# EAGLE design sensor-board (EAGLE 7.1.0)
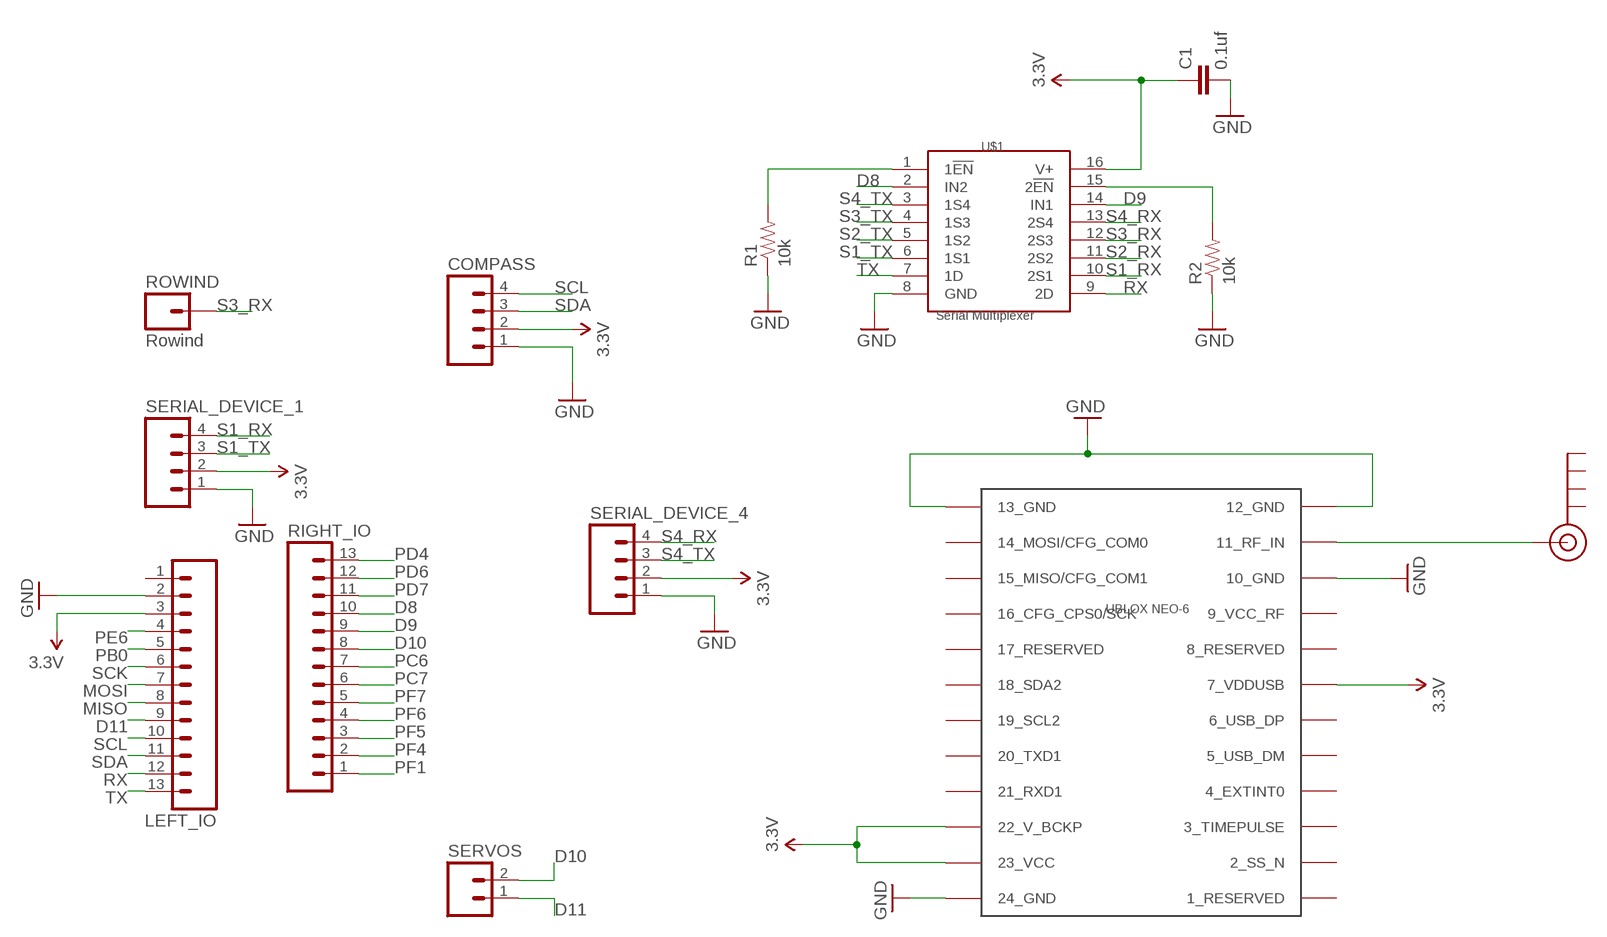
[diagram p0: schematic, sheet 1]

## Parts
C1  0.1uf  C0805  [C0805]
COMPASS  M04PTH  [1X04]
J$1  SMA_EDGE  [SMA-EDGE]
LEFT_IO  M13  [1X13]
R1  10k  10KOHM-1/4W-1%(PTH)HORIZ  [AXIAL-0.3]
R2  10k  10KOHM-1/4W-1%(PTH)HORIZ  [AXIAL-0.3]
RIGHT_IO  M13  [1X13]
ROWIND  Rowind  M01PTH  [1X01]
SERIAL_DEVICE_1  M04PTH  [1X04]
SERIAL_DEVICE_4  M04PTH  [1X04]
SERVOS  M02PTH  [1X02]
U$1  Serial Multiplexer  TS3A5017  [16TSSOP]
U$2  UBLOX_NEO-6  [UBLOX_NEO-6P]

## Nets
3.3V: C1.1 COMPASS.2 LEFT_IO.3 SERIAL_DEVICE_1.2 SERIAL_DEVICE_4.2 U$1.16(V+) U$2.7_VDDUSB U$2.22_V_BCKP U$2.23_VCC
D8: RIGHT_IO.10 U$1.2(IN2)
D9: RIGHT_IO.9 U$1.14(IN1)
D10: RIGHT_IO.8 SERVOS.2
D11: LEFT_IO.9 SERVOS.1
GND: C1.2 COMPASS.1 LEFT_IO.2 R1.P$1 R2.P$1 SERIAL_DEVICE_1.1 SERIAL_DEVICE_4.1 U$1.8(GND) U$2.10_GND U$2.12_GND U$2.13_GND U$2.24_GND
MISO: LEFT_IO.8
MOSI: LEFT_IO.7
N$1: R1.P$2 U$1.1(1!EN)
N$2: R2.P$2 U$1.15(2!EN)
N$3: J$1.SIG(SIGNAL) U$2.11_RF_IN
PB0: LEFT_IO.5
PC6: RIGHT_IO.7
PC7: RIGHT_IO.6
PD4: RIGHT_IO.13
PD6: RIGHT_IO.12
PD7: RIGHT_IO.11
PE6: LEFT_IO.4
PF1: RIGHT_IO.1
PF4: RIGHT_IO.2
PF5: RIGHT_IO.3
PF6: RIGHT_IO.4
PF7: RIGHT_IO.5
RX: LEFT_IO.12 U$1.9(2D)
S1_RX: SERIAL_DEVICE_1.4 U$1.10(2S1)
S1_TX: SERIAL_DEVICE_1.3 U$1.6(1S1)
S2_RX: U$1.11(2S2)
S2_TX: U$1.5(1S2)
S3_RX: ROWIND.1 U$1.12(2S3)
S3_TX: U$1.4(1S3)
S4_RX: SERIAL_DEVICE_4.4 U$1.13(2S4)
S4_TX: SERIAL_DEVICE_4.3 U$1.3(1S4)
SCK: LEFT_IO.6
SCL: COMPASS.4 LEFT_IO.10
SDA: COMPASS.3 LEFT_IO.11
TX: LEFT_IO.13 U$1.7(1D)
Unconnected: J$1.GND@0(GND) J$1.GND@1(GND) J$1.GND@2(GND) J$1.GND@3(GND) LEFT_IO.1 U$2.1_RESERVED U$2.2_SS_N U$2.3_TIMEPULSE U$2.4_EXTINT0 U$2.5_USB_DM U$2.6_USB_DP U$2.8_RESERVED U$2.9_VCC_RF U$2.14_MOSI/CFG_COM0 U$2.15_MISO/CFG_COM1 U$2.16_CFG_CPS0/SCK U$2.17_RESERVED U$2.18_SDA2 U$2.19_SCL2 U$2.20_TXD1 U$2.21_RXD1

## Library data of the parts
C1 = ELL-i-Passives:C: Surface Mount Capasitors — in standard sizes A capacitor used to store energy electrostatically in an electric field. If you need a high-value capacitor, consider using a polarised capacitor to save space. Wikipedia article on capacitors <https://en.wikipedia.org/wiki/Capacitor>
COMPASS SERIAL_DEVICE_1 SERIAL_DEVICE_4 = SparkFun-Connectors:M04: Header 4 Standard 4-pin 0.1" header. Use with straight break away headers (SKU : PRT-00116), right angle break away headers (PRT-00553), swiss pins (PRT-00743), machine pins (PRT-00117), and female headers (PRT-00115). Molex polarized connector foot print use with SKU : PRT-08231 with associated crimp pins and housings. 1MM SMD Version SKU: PRT-10208
J$1 = SparkFun-Connectors:SMA_EDGE: SMA Antenna Connector End launch SMA connector. The paste layer has been removed so that the connector can be hand soldered onto the board after reflow.
LEFT_IO RIGHT_IO = SparkFun-Connectors:M13: 13-pin single row .1" header
R1 R2 = SparkFun-Resistors:10KOHM-1/4W-1%(PTH): RES-12183; PROD_ID: RES-12183
ROWIND = SparkFun-Connectors:M01: Header 1 Standard 1-pin 0.1" header. Use with straight break away headers (SKU : PRT-00116), right angle break away headers (PRT-00553), swiss pins (PRT-00743), machine pins (PRT-00117), and female headers (PRT-00115).
SERVOS = SparkFun-Connectors:M02: Standard 2-pin 0.1" header. Use with - straight break away headers ( PRT-00116) - right angle break away headers (PRT-00553) - swiss pins (PRT-00743) - machine pins (PRT-00117) - female headers (PRT-00115) Molex polarized connector foot print use with: PRT-08233 with associated crimp pins and housings. 2.54_SCREWTERM for use with PRT-10571. 3.5mm Screw Terminal footprints for PRT-08084 5mm Screw Terminal footprints for use with PRT-08432
U$1 = BaseApp:TS3A5017
U$2 = Ava:UBLOX_NEO-6: UBLOX NEO-6 GPS MODULE Author Anthony Stirk / http://ava.upuaut.net http://www.u-blox.com/images/downloads/Product_Docs/LEA-6_NEO-6_MAX-6_HardwareIntegrationManual_%28GPS.G6-HW-09007%29.pdf http://www.u-blox.com/images/downloads/Product_Docs/NEO-6_DataSheet_%28GPS.G6-HW-09005%29.pdf

## Board
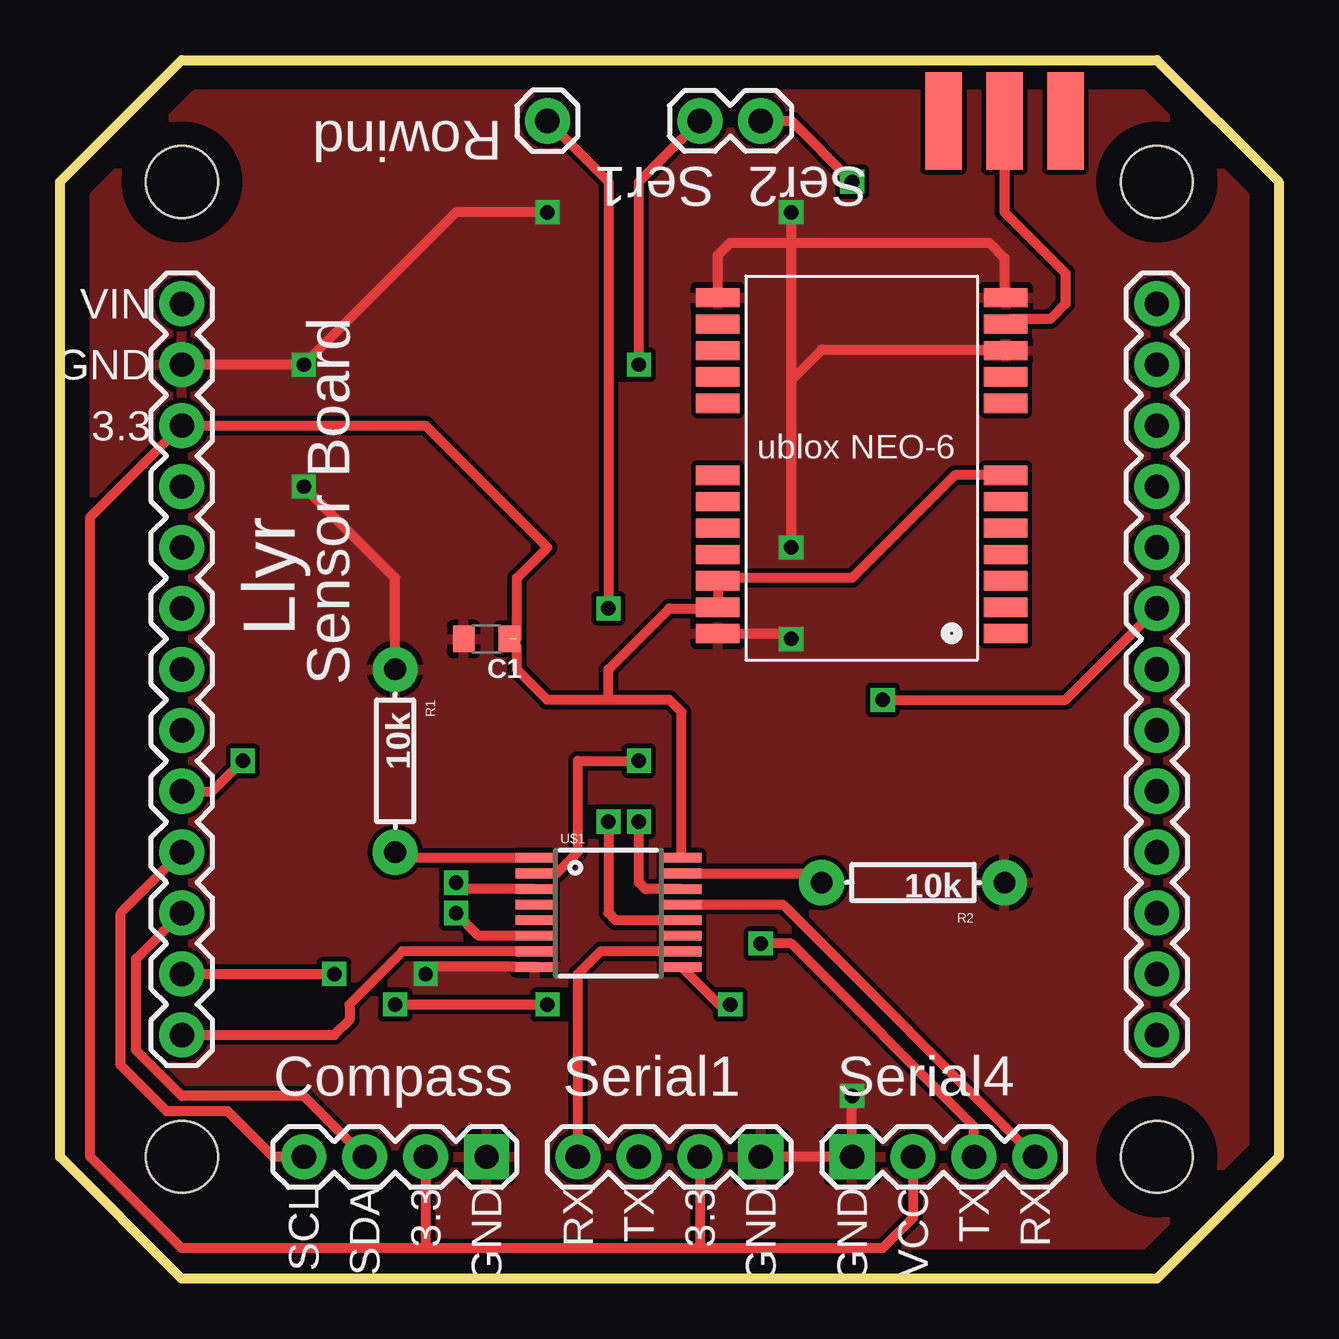
[diagram p1: board, top side]
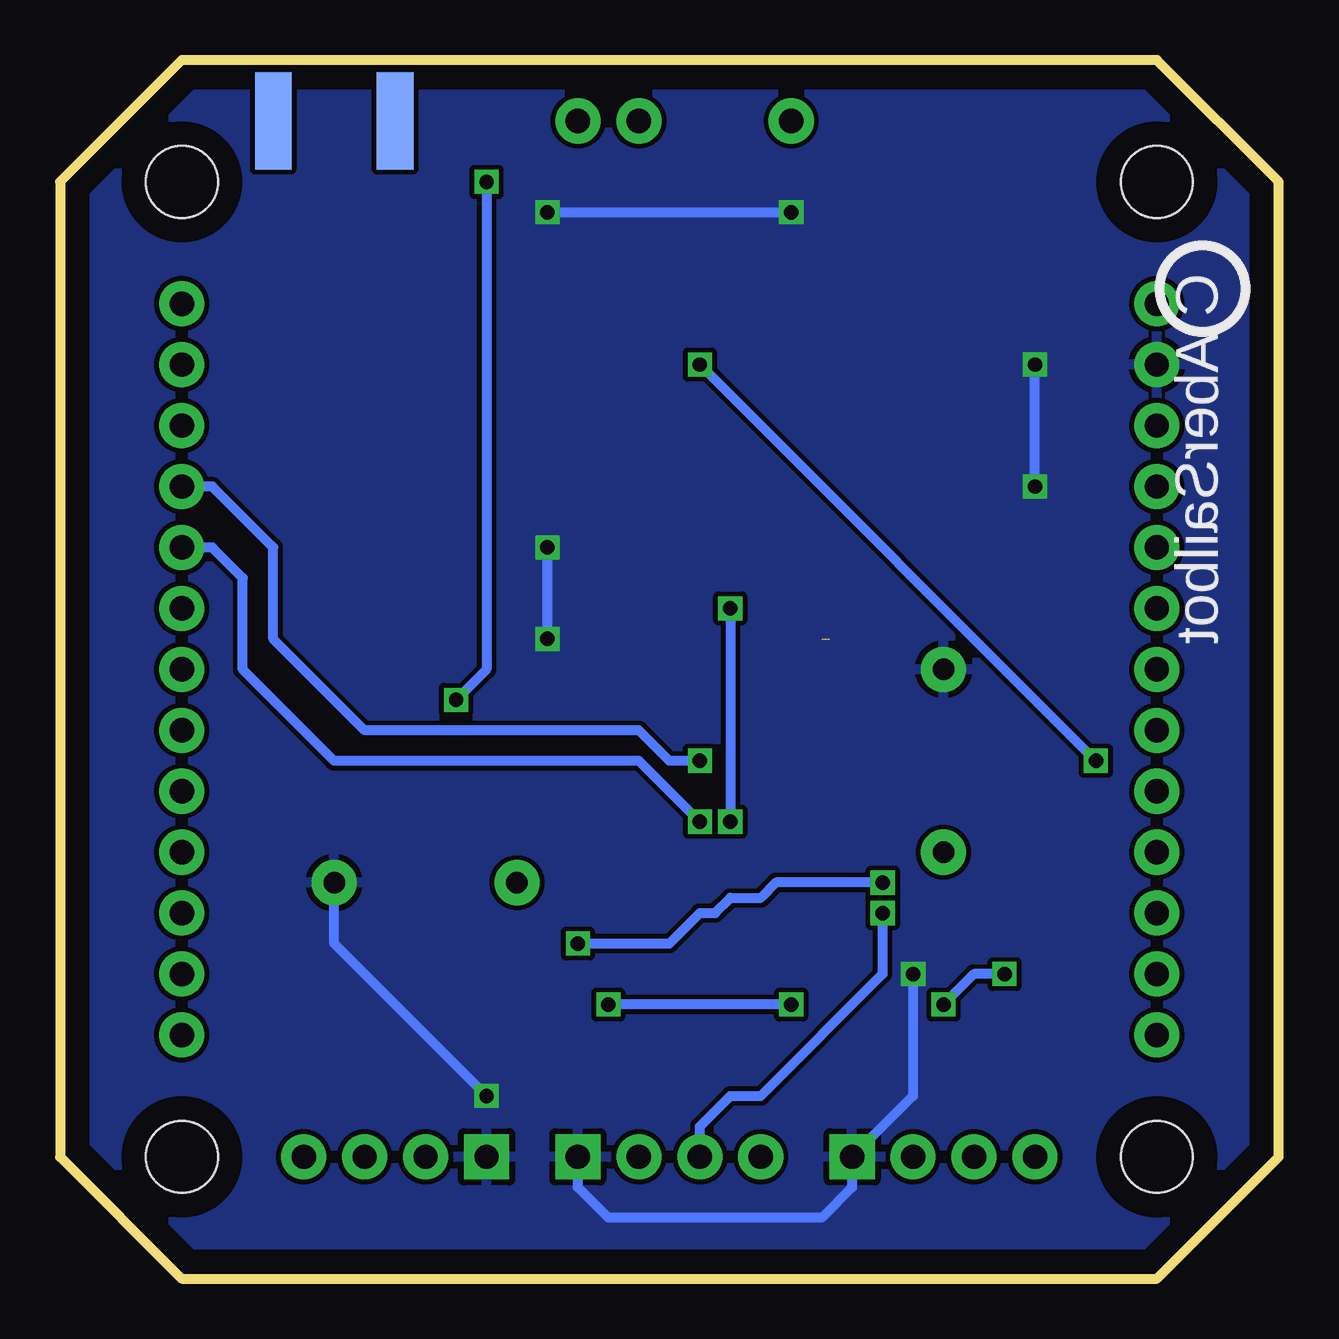
[diagram p2: board, bottom side, seen from below]

Size 50.8 x 50.8 mm. Coordinates in mm from the lower left corner, seen from the top.
Outline: 0,5.08 0,45.72 5.08,50.8 45.72,50.8 50.8,45.72 50.8,5.08 45.72,0 5.08,0 0,5.08
Copper layers (1*16): Top 0.035mm / dielectric 1.5mm / Bottom 0.035mm
Design rules "default": minimum track width 10mil, minimum drill 24mil, track to track 8mil, track to pad 8mil, pad to pad 8mil, via to via 8mil, smd to smd 8mil, copper to edge 40mil, drill to drill 8mil, minimum pad ring 10mil, minimum via ring 8mil, stop-mask expansion 4mil, vias tented up to drill 0mil, thermal gap 10mil
Holes 3 mm at 5.08,45.72 45.72,45.72 45.72,5.08 5.08,5.08

### Footprints (pad centres in the part's own frame; a part is rotated, then mirrored left to right if it is on the bottom)
C0805 = smd 0.9 x 1.1: 1 -0.95,0; 2 0.95,0
1X04 = drill 1.016 pad 1.88 square: 1 0,0 | drill 1.016 pad 1.88: 2 2.54,0; 3 5.08,0; 4 7.62,0
SMA-EDGE = smd 1.524 x 4.064: GND@0 0,0; GND@1 5.08,0; SIG 2.54,0 | smd 1.524 x 4.064 bottom: GND@2 0,0; GND@3 5.08,0
1X13 = drill 1.016 pad 1.88: 1 0,0; 2 2.54,0; 3 5.08,0; 4 7.62,0; 5 10.16,0; 6 12.7,0; 7 15.24,0; 8 17.78,0; 9 20.32,0; 10 22.86,0; 11 25.4,0; 12 27.94,0; 13 30.48,0
AXIAL-0.3 = drill 0.9 pad 1.88: P$1 -3.81,0; P$2 3.81,0
1X01 = drill 1.016 pad 1.88: 1 0,0
1X02 = drill 1.016 pad 1.88: 1 0,0; 2 2.54,0
16TSSOP = smd 0.4 x 1.65: 1 -2.305,-3.05; 2 -1.655,-3.05; 3 -1.005,-3.05; 4 -0.355,-3.05; 5 0.295,-3.05; 6 0.945,-3.05; 7 1.595,-3.05; 8 2.245,-3.05; 9 2.245,3.05; 10 1.595,3.05; 11 0.945,3.05; 12 0.295,3.05; 13 -0.355,3.05; 14 -1.005,3.05; 15 -1.655,3.05; 16 -2.305,3.05
UBLOX_NEO-6P = smd 1.8 x 0.8: 1_RESERVED 6.4,-7.4; 2_SS_N 6.4,-6.3; 3_TIMEPULSE 6.4,-5.2; 4_EXTINT0 6.4,-4.1; 5_USB_DM 6.4,-3; 6_USB_DP 6.4,-1.9; 7_VDDUSB 6.4,-0.8; 8_RESERVED 6.4,2.2; 9_VCC_RF 6.4,3.3; 10_GND 6.4,4.4; 11_RF_IN 6.4,5.5; 12_GND 6.4,6.6; 13_GND -5.6,6.6; 14_MOSI/CFG_COM0 -5.6,5.5; 15_MISO/CFG_COM1 -5.6,4.4; 16_CFG_CPS0/SCK -5.6,3.3; 17_RESERVED -5.6,2.2; 18_SDA2 -5.6,-0.8; 19_SCL2 -5.6,-1.9; 20_TXD1 -5.6,-3; 21_RXD1 -5.6,-4.1; 22_V_BCKP -5.6,-5.2; 23_VCC -5.6,-6.3; 24_GND -5.6,-7.4

### Placement (x,y rotation side)
C1  17.78,26.67 180 top
COMPASS  17.78,5.08 180 top
J$1  36.83,48.26 0 top
LEFT_IO  5.08,40.64 270 top
R1  13.97,21.59 270 top
R2  35.56,16.51 180 top
RIGHT_IO  45.72,10.16 90 top
ROWIND  20.32,48.26 0 top
SERIAL_DEVICE_1  29.21,5.08 180 top
SERIAL_DEVICE_4  33.02,5.08 0 top
SERVOS  26.67,48.26 0 top
U$1  22.86,15.24 270 top
U$2  33.02,34.29 0 top

### Tracks (layer width: path | path; a pad name or v marks a point on that pad's centre or on a via)
3.3V  (1 unrouted)
  Top 0.406: U$2.7_VDDUSB 37.3,33.49 33.02,29.21 27.54,29.21 U$2.22_V_BCKP | LEFT_IO.3 15.24,35.56 20.32,30.48 19.05,29.21 19.05,26.67 | 27.3,29.21 U$2.22_V_BCKP | SERIAL_DEVICE_4.2 35.56,2.54 34.29,1.27 26.67,1.27 | SERIAL_DEVICE_1.2 26.67,1.27 | 26.67,1.27 15.24,1.27 | 15.24,1.27 5.08,1.27 1.27,5.08 1.27,31.75 LEFT_IO.3 | 2.54,33.02 LEFT_IO.3 | U$1.16 25.91,23.62 25.4,24.13 22.86,24.13 | 22.86,24.13 20.32,24.13 19.05,25.4 19.05,26.35 C1.1 | 22.86,24.13 22.86,25.4 25.4,27.94 27.37,27.94 U$2.23_VCC U$2.22_V_BCKP | COMPASS.2 15.24,1.27
D8  (via drill 0.6)
  Top 0.406: U$1.2 20.7,16.89 21.59,17.78 21.59,21.59 v24.13,21.59
  Bottom 0.406: v24.13,21.59 25.4,21.59 26.67,22.86 38.1,22.86 41.91,26.67 41.91,30.48 44.45,33.02 RIGHT_IO.10
D9  (via drill 0.6)
  Top 0.406: U$1.14 24.39,16.25 24.13,16.51 v24.13,19.05
  Bottom 0.406: v24.13,19.05 26.67,21.59 39.37,21.59 43.18,25.4 43.18,29.21 44.45,30.48 RIGHT_IO.9
D10  (via drill 0.6)
  Top 0.406: SERVOS.2 30.48,48.26 v33.02,45.72 | v34.29,24.13 41.91,24.13 RIGHT_IO.8
  Bottom 0.406: v33.02,45.72 33.02,25.4 v34.29,24.13
D11  (via drill 0.6)
  Top 0.406: LEFT_IO.9 6.35,20.32 v7.62,21.59 | v24.13,38.1 24.13,45.72 SERVOS.1
  Bottom 0.406: v7.62,21.59 v24.13,38.1
GND  (via drill 0.6)
  Top 0.406: U$2.13_GND 27.42,42.66 27.94,43.18 30.48,43.18 | 30.48,43.18 38.73,43.18 39.37,42.55 39.37,40.94 U$2.12_GND | SERIAL_DEVICE_1.1 SERIAL_DEVICE_4.1 v33.02,7.62 | U$1.8 15.54,12.99 v15.24,12.7 | R1.P$1 13.97,29.21 v10.16,33.02 | LEFT_IO.2 v10.16,38.1 16.51,44.45 v20.32,44.45 | U$2.10_GND 39.38,38.73 31.75,38.73 30.48,37.47 v30.48,30.48 30.48,43.18 | 30.48,43.18 v30.48,44.45 | U$2.24_GND 30.48,26.89 v30.48,26.67 30.26,26.89 U$2.24_GND
  Bottom 0.406: v15.24,12.7 15.24,7.62 COMPASS.1 17.78,3.81 19.05,2.54 27.94,2.54 29.21,3.81 SERIAL_DEVICE_1.1 | v10.16,33.02 v10.16,38.1 | v30.48,26.67 v30.48,30.48 | v30.48,44.45 v20.32,44.45 | v33.02,7.62 39.37,13.97 R2.P$1
  pour Top: 0,31.75 0,5.08 5.08,0 45.72,0 50.8,5.08 50.8,45.72 45.72,50.8 5.08,50.8 0,45.72
  pour Bottom: 0,45.72 0,5.08 5.08,0 45.72,0 50.8,5.08 50.8,45.72 45.72,50.8 5.08,50.8
N$1
  Top 0.406: U$1.1 14.21,17.55 R1.P$2
N$2
  Top 0.406: U$1.15 31.36,16.89 R2.P$2
N$3
  Top 0.406: J$1.SIG 39.37,44.45 41.91,41.91 41.91,40.64 41.27,40.01 39.63,40.01 U$2.11_RF_IN
RX  (via drill 0.6)
  Top 0.406: LEFT_IO.12 v11.43,12.7 | v27.94,11.43 27.48,11.43 U$1.9 | v13.97,11.43 v20.32,11.43
  Bottom 0.406: v11.43,12.7 12.7,12.7 v13.97,11.43 | v20.32,11.43 v27.94,11.43
S1_RX
  Top 0.406: SERIAL_DEVICE_1.4 21.59,12.7 22.54,13.64 U$1.10
S1_TX  (via drill 0.6)
  Top 0.406: U$1.6 17.45,14.29 v16.51,15.24
  Bottom 0.406: SERIAL_DEVICE_1.3 24.13,6.35 22.86,7.62 21.59,7.62 16.51,12.7 v16.51,15.24
S3_RX  (via drill 0.6)
  Top 0.406: U$1.12 23.16,14.95 22.86,15.24 v22.86,19.05 | v22.86,27.94 22.86,45.72 ROWIND.1
  Bottom 0.406: v22.86,27.94 v22.86,19.05
S4_RX
  Top 0.406: U$1.13 30.12,15.6 SERIAL_DEVICE_4.4
S4_TX  (via drill 0.6)
  Top 0.406: SERIAL_DEVICE_4.3 38.1,6.35 30.48,13.97 v29.21,13.97 | U$1.3 16.77,16.25 v16.51,16.51
  Bottom 0.406: v29.21,13.97 25.4,13.97 24.13,15.24 23.5,15.24 22.86,15.88 21.59,15.88 20.95,16.51 v16.51,16.51
SCL
  Top 0.406: COMPASS.4 8.89,5.08 6.99,6.99 4.45,6.99 2.54,8.89 2.54,15.24 LEFT_IO.10
SDA
  Top 0.406: COMPASS.3 10.16,7.62 5.08,7.62 3.17,9.53 3.17,13.34 LEFT_IO.11
TX
  Top 0.406: LEFT_IO.13 11.43,10.16 12.06,10.79 12.06,11.43 14.28,13.64 U$1.7

### Text on the board
tPlace: Rowind | Ser1 | Ser2 | VIN | GND | 3.3 | Llyr | Sensor Board | Compass | Serial1 | Serial4 | SCL | SDA | 3.3 | GND | RX | TX | 3.3 | GND | GND | VCC | TX | RX
bPlace: C AberSailbot